# EasyEDA Pro project ESD_System.eprj, schematic Schematic3
Board Name: Facial_Rec_Board; Create Date: 2026-06-29; Page Name: P1; Project Name: ESD_System; Schematic Name: Schematic3; Update Date: 2026-06-29; Company: EasyEDA.com; Page Size: A4; Version: V1.0
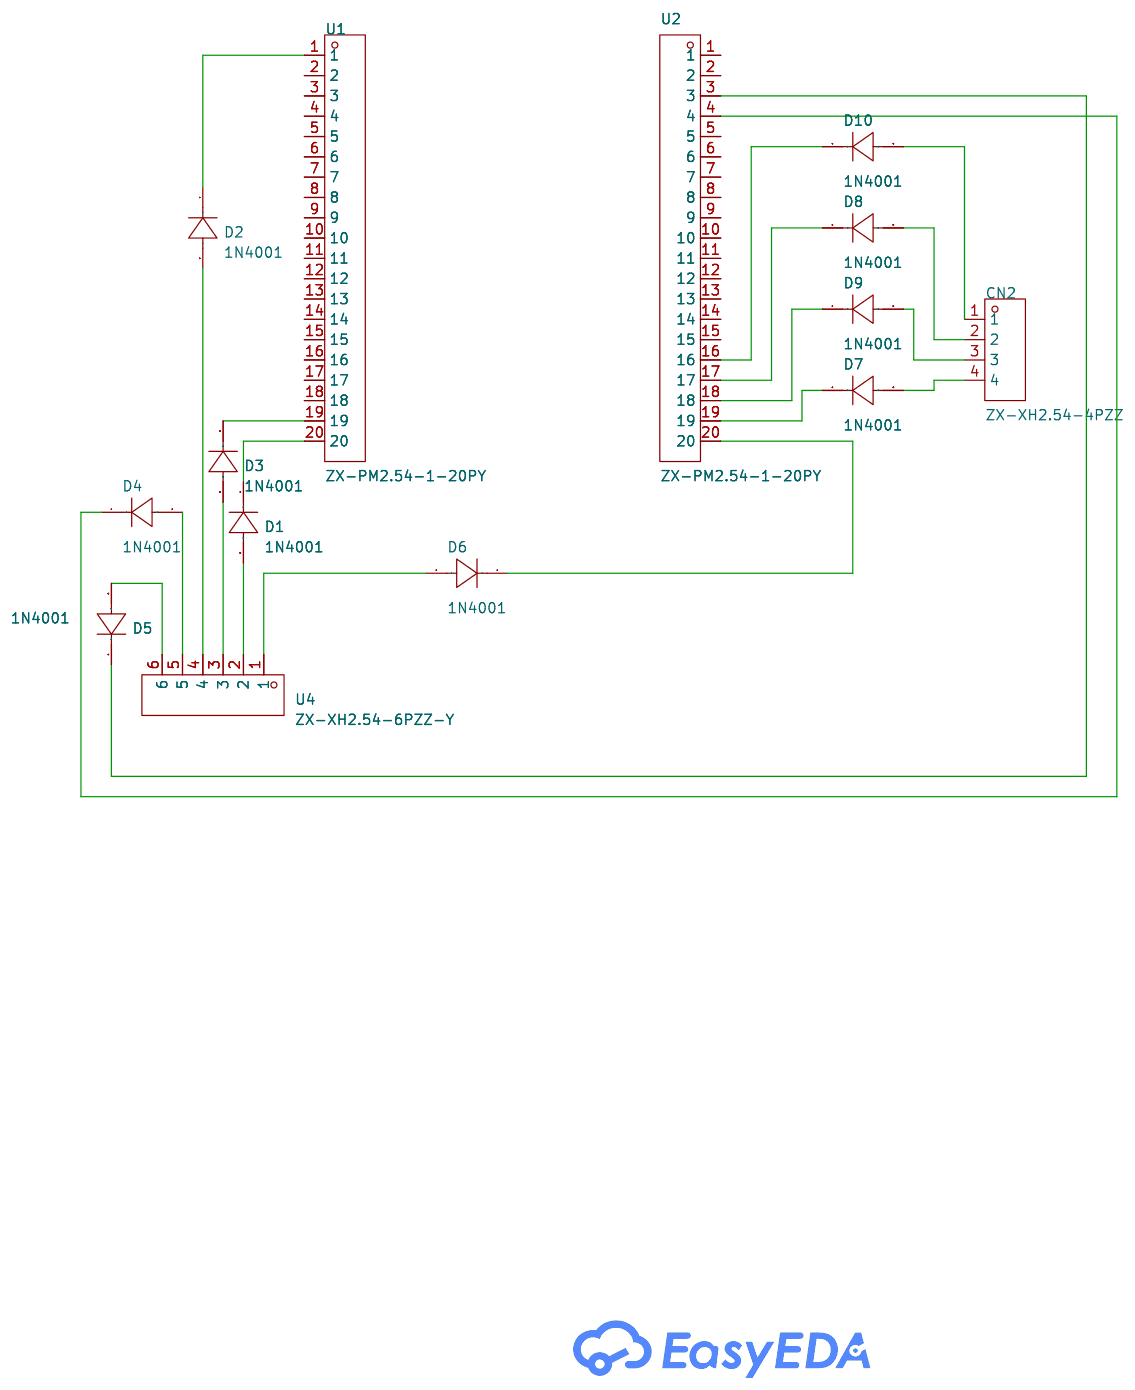
[diagram p2: schematic sheet]

## Parts
CN2  ZX-XH2.54-4PZZ  [CONN-TH_4P-P2.50_4PIN]
D1  1N4001  [DO-41_BD2.4-L4.7-P8.70-D0.9-RD]
D2  1N4001  [DO-41_BD2.4-L4.7-P8.70-D0.9-RD]
D3  1N4001  [DO-41_BD2.4-L4.7-P8.70-D0.9-RD]
D4  1N4001  [DO-41_BD2.4-L4.7-P8.70-D0.9-RD]
D5  1N4001  [DO-41_BD2.4-L4.7-P8.70-D0.9-RD]
D6  1N4001  [DO-41_BD2.4-L4.7-P8.70-D0.9-RD]
D7  1N4001  [DO-41_BD2.4-L4.7-P8.70-D0.9-RD]
D8  1N4001  [DO-41_BD2.4-L4.7-P8.70-D0.9-RD]
D9  1N4001  [DO-41_BD2.4-L4.7-P8.70-D0.9-RD]
D10  1N4001  [DO-41_BD2.4-L4.7-P8.70-D0.9-RD]
U1  ZX-PM2.54-1-20PY  [HDR-TH_20P-P2.54-V-F]
U2  ZX-PM2.54-1-20PY  [HDR-TH_20P-P2.54-V-F]
U4  ZX-XH2.54-6PZZ-Y  [CONN-TH_6P-P2.54_C9900015703]

## Library data of the parts
CN2 = ZX-XH2.54-4PZZ: Pins Structure:1x4P Pitch:2.5mm Mounting Type:Through Hole Reference Series:XH Number of Pins:4P Number of Rows:1 Number of PINs Per Row:4 Row Spacing:- Current Rating:3A Contact Material:Brass Contact Plating:Tin Operating Temperature:-25℃~+85℃ Operating; LCSC Part Name: 1x4P 间距:2.5mm 直插 系列:XH; Supplier Part: C7429634; Manufacturer: Megastar(兆星); Supplier Footprint: 插件,P=2.5mm; JLCPCB Part Class: Extended Part; Datasheet: https://item.szlcsc.com/datasheet/ZX-XH2.54-4PZZ/8427551.html; Supplier: LCSC; Pins Structure: 1x4P; Pitch: 2.5mm; Mounting Type: Through Hole; Reference Series: XH; Number of Pins: 4P; Number of Rows: 1; Number of PINs Per Row: 4; Current Rating: 3A; Contact Material: Brass; Contact Plating: Tin; Operating Temperature: -25℃~+85℃; Voltage Rating: 250V; Plastic Material: PA66; Flame Retardant Rating: UL94V-0; Color: White; Z-Height of the Board: 7mm; X-Length of Bottom Edge on Board (Spacing Line): 12.5mm; Y-Width of Bottom Edge on Board: 5.9mm
D1-D10 = 1N4001_C7544975: Voltage - Forward(Vf@If):1.1V@1.0A Voltage - DC Reverse(Vr):50V Current - Rectified:1A Reverse Leakage Current (Ir):5uA Non-Repetitive Peak Forward Surge Current:30A Operating Junction Temperature Range:-55℃~+150℃ Operating Junction Temperature Range:-55℃; LCSC Part Name: 50V 1A; Supplier Part: C7544975; Manufacturer: LJ(朗捷); Supplier Footprint: DO-41; JLCPCB Part Class: Extended Part; Datasheet: https://item.szlcsc.com/datasheet/1N4001/8655186.html; Supplier: LCSC; Voltage - Forward(Vf@If): 1.1V@1.0A; Voltage - DC Reverse(Vr): 50V; Current - Rectified: 1A; Reverse Leakage Current (Ir): 5uA; Non-Repetitive Peak Forward Surge Current: 30A; Operating Junction Temperature Range: -55℃~+150℃
U1 U2 = ZX-PM2.54-1-20PY: Holes Structure:1x20P Pitch:2.54mm Row Spacing:- Circular Hole / Square Hole:Square Hole Mounting Type:Through Hole Number of Rows:1 Number of Positions:20P Current Rating:3A Voltage Rating (Max):- Holes Direction:Top Insulation Height:8.5mm Contact Mater; LCSC Part Name: 1x20P 间距:2.54mm 直插; Supplier Part: C7499336; Manufacturer: Megastar(兆星); Supplier Footprint: 插件,P=2.54mm; JLCPCB Part Class: Extended Part; Datasheet: https://item.szlcsc.com/datasheet/ZX-PM2.54-1-20PY/8573997.html; Supplier: LCSC; Holes Structure: 1x20P; Pitch: 2.54mm; Circular Hole / Square Hole: Square Hole; Mounting Type: Through Hole; Number of Rows: 1; Number of Positions: 20P; Current Rating: 3A; Holes Direction: Top; Insulation Height: 8.5mm; Contact Material: Brass; Contact Plating: Gold; Operating Temperature: -40℃~+105℃; PIN Length: 3.2mm
U4 = ZX-XH2.54-6PZZ-Y: Pins Structure:1x6P Pitch:2.5mm Mounting Type:Through Hole Reference Series:XH Number of Pins:6P Number of Rows:1 Number of PINs Per Row:6 Row Spacing:- Current Rating:3A Contact Material:Copper Alloy Contact Plating:Tin Operating Temperature:-25℃~+85℃ Op; LCSC Part Name: 1x6P 间距:2.5mm 直插 系列:XH; Supplier Part: C22388688; Manufacturer: Megastar(兆星); Supplier Footprint: 插件,P=2.5mm; JLCPCB Part Class: Extended Part; Datasheet: https://item.szlcsc.com/datasheet/ZX-XH2.54-6PZZ-Y/23957036.html; Supplier: LCSC; Pins Structure: 1x6P; Pitch: 2.5mm; Mounting Type: Through Hole; Reference Series: XH; Number of Pins: 6P; Number of Rows: 1; Number of PINs Per Row: 6; Current Rating: 3A; Contact Material: Copper Alloy; Contact Plating: Tin; Operating Temperature: -25℃~+85℃; Voltage Rating: 250V; Plastic Material: PA66; Color: Yellow; Z-Height of the Board: 7mm; X-Length of Bottom Edge on Board (Spacing Line): 17.5mm; Y-Width of Bottom Edge on Board: 5.75mm

## Nets
$1N546: D1.1(K) U1.20
$1N551: D1.2(A) U4.2
$1N1659: D3.1(K) U1.19
$1N1663: D3.2(A) U4.3
$1N1681: D2.1(K) U1.1
$1N1686: D2.2(A) U4.4
$1N1690: D4.2(A) U4.5
$1N1696: D4.1(K) U2.4
$1N1699: D5.2(A) U4.6
$1N1705: D5.1(K) U2.3
$1N1809: D6.2(A) U4.1
$1N1813: D6.1(K) U2.20
$1N2019: CN2.1 D10.2(A)
$1N2024: CN2.2 D8.2(A)
$1N2034: CN2.3 D9.2(A)
$1N2041: CN2.4 D7.2(A)
$1N2048: D7.1(K) U2.19
$1N2054: D9.1(K) U2.18
$1N2061: D8.1(K) U2.17
$1N2068: D10.1(K) U2.16

Not connected (* = marked no-connect by the designer): U1 2 3 4 5 6 7 8 9 10 11 12 13 14 15 16 17 18; U2 1 2 5 6 7 8 9 10 11 12 13 14 15
